# Altium project ProjektowanieObwodowDrukowanych.PrjPcb
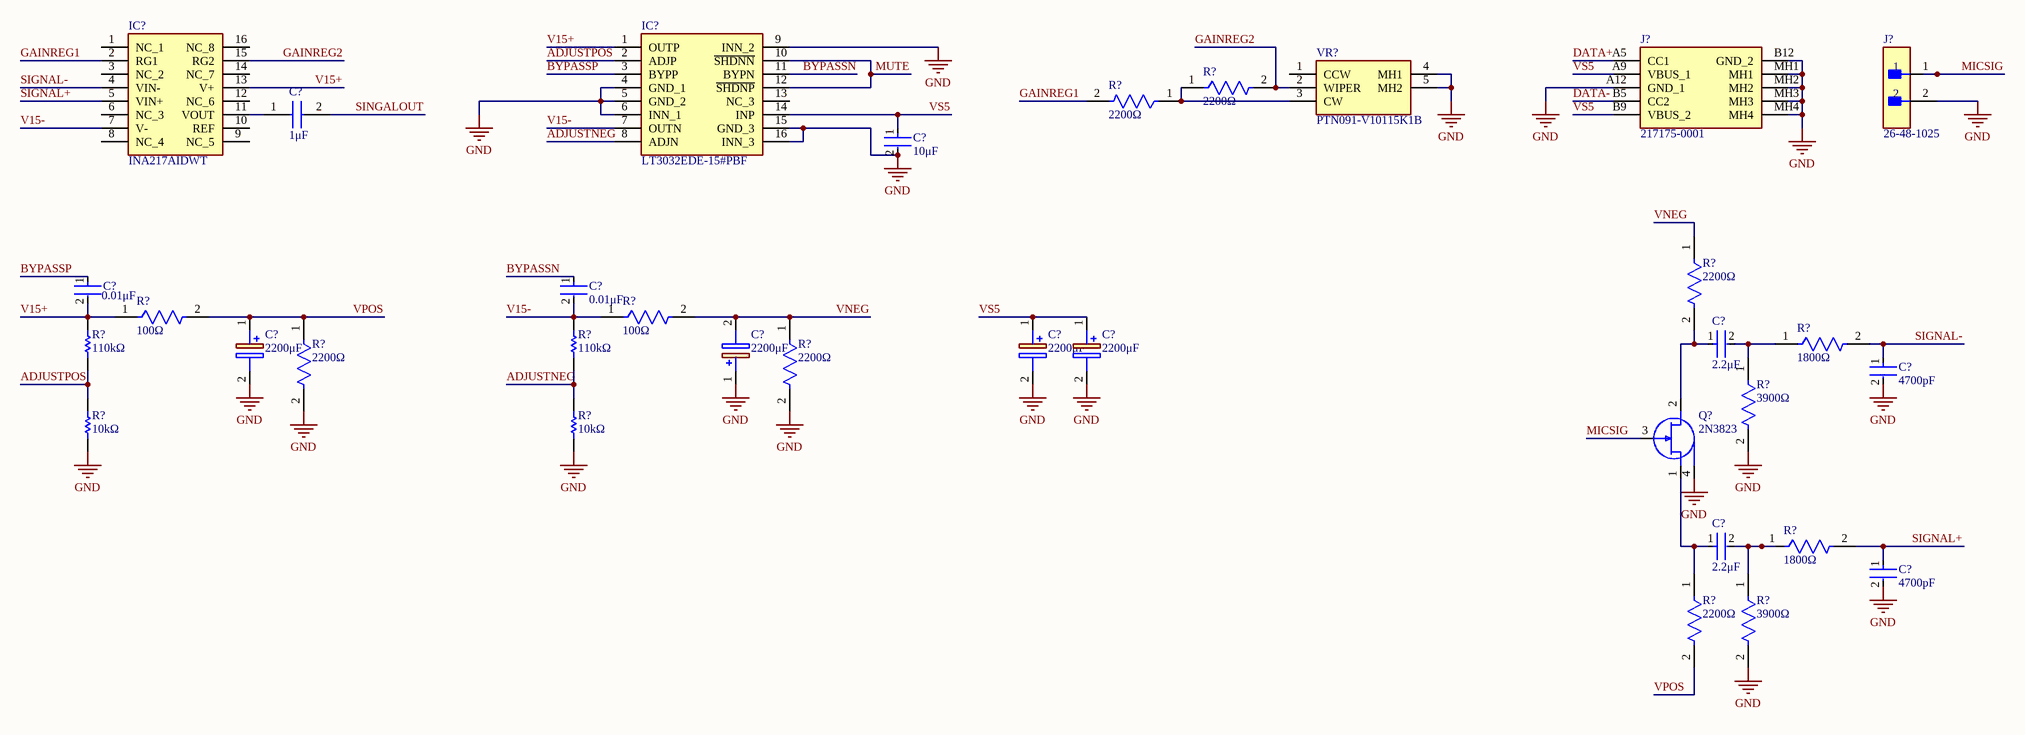
[diagram p0: Schemat.SchDoc]
1 sheet, 34 parts. Net scope: global (net labels, ports and power ports of the same name join across sheets).

## Sheet Schemat.SchDoc
size A3; SheetNumber: 1; SheetTotal: 1

### Parts
(Parts that share a designator on the sheet are numbered #1, #2 ... from top to bottom, then left to right.)
C?#1  1μF  [BFC241671005]
C?#2  10μF  [FP-C0603C-CF-MFG]
C?#3  0.01μF  [FP-C0603C-CF-MFG]
C?#4  0.01μF  [FP-C0603C-CF-MFG]
C?#5  2200μF  [CAPPRD500W65D1250H2700]
C?#6  2200μF  [CAPPRD500W65D1250H2700]
C?#7  2200μF  [CAPPRD500W65D1250H2700]
C?#8  2.2μF  [FP-R82DC4100DQ60J-MFG]
C?#9  4700pF  [FP-R82DC4100DQ60J-MFG]
C?#10  2200μF  [CAPPRD500W65D1250H2700]
C?#11  2.2μF  [FP-R82DC4100DQ60J-MFG]
C?#12  4700pF  [FP-R82DC4100DQ60J-MFG]
IC?#1  INA217AIDWT  [SOIC127P1030X265-16N]
IC?#2  LT3032EDE-15#PBF  [LT3032EDE15PBF]
J?#1  217175-0001  [2171750001]
J?#2  26-48-1025  [FP-26-48-1025-MFG]
Q?  2N3823  [2N4222A]
R?#1  2200Ω  [FP-MBB0207-MFG]
R?#2  2200Ω  [FP-MBB0207-MFG]
R?#3  2200Ω  [FP-MBB0207-MFG]
R?#4  100Ω  [FP-MRS25-MFG]
R?#5  2200Ω  [FP-MBB0207-MFG]
R?#6  100Ω  [FP-MRS25-MFG]
R?#7  2200Ω  [FP-MBB0207-MFG]
R?#8  1800Ω  [FP-MBB0207-MFG]
R?#9  110kΩ  [RESC1609X50X30NL8T20]
R?#10  110kΩ  [RESC1609X50X30NL8T20]
R?#11  3900Ω  [FP-MBB0207-MFG]
R?#12  10kΩ  [RESC1609X50X30NL8T20]
R?#13  10kΩ  [RESC1609X50X30NL8T20]
R?#14  1800Ω  [FP-MBB0207-MFG]
R?#15  2200Ω  [FP-MBB0207-MFG]
R?#16  3900Ω  [FP-MBB0207-MFG]
VR?  PTN091-V10115K1B  [PTN091V10115K1B]

### Nets
GND: C?#2.2 C?#5.2(-) C?#6.2(-) C?#7.2(-) C?#9.2 C?#10.1(+) C?#12.2 IC?#2.4(GND_1) IC?#2.5(GND_2) IC?#2.6(INN_1) IC?#2.9(INN_2) IC?#2.15(GND_3) IC?#2.16(INN_3) J?#1.A12(GND_1) J?#1.B12(GND_2) J?#1.MH1 J?#1.MH2 J?#1.MH3 J?#1.MH4 J?#2.2 Q?.4(C) R?#5.2 R?#7.2 R?#11.2 R?#12.1 R?#13.1 R?#16.2 VR?.4(MH1) VR?.5(MH2)
ADJUSTNEG: IC?#2.8(ADJN) R?#10.1 R?#13.2
ADJUSTPOS: IC?#2.2(ADJP) R?#9.1 R?#12.2
BYPASSN: C?#4.1 IC?#2.11(BYPN)
BYPASSP: C?#3.1 IC?#2.3(BYPP)
DATA+: J?#1.A5(CC1)
DATA-: J?#1.B5(CC2)
GAINREG1: IC?#1.2(RG1) R?#2.2
GAINREG2: IC?#1.15(RG2) R?#1.2 VR?.2(WIPER)
MICSIG: J?#2.1 Q?.3(G)
MUTE: IC?#2.10(~{SHDNN}) IC?#2.12(~{SHDNP})
SIGNAL+: C?#12.1 IC?#1.5(VIN+) R?#14.2
SIGNAL-: C?#9.1 IC?#1.4(VIN-) R?#8.2
SINGALOUT: C?#1.2
V15+: C?#3.2 IC?#1.13(V+) IC?#2.1(OUTP) R?#4.1 R?#9.2
V15-: C?#4.2 IC?#1.7(V-) IC?#2.7(OUTN) R?#6.1 R?#10.2
VNEG: C?#10.2(-) R?#3.1 R?#6.2 R?#7.1
VPOS: C?#5.1(+) R?#4.2 R?#5.1 R?#15.2
VS5: C?#2.1 C?#6.1(+) C?#7.1(+) IC?#2.14(INP) J?#1.A9(VBUS_1) J?#1.B9(VBUS_2)
NetC?#1_1: C?#1.1 IC?#1.11(VOUT)
NetC?#8_1: C?#8.1 Q?.2(D) R?#3.2
NetC?#8_2: C?#8.2 R?#8.1 R?#11.1
NetC?#11_1: C?#11.1 Q?.1(S) R?#15.1
NetC?#11_2: C?#11.2 R?#14.1 R?#16.1
NetR?#1_1: R?#1.1 R?#2.1 VR?.3(CW)

Not connected (* = marked no-connect by the designer): IC?#1 1(NC_1) 3(NC_2) 6(NC_3) 8(NC_4) 9(NC_5) 10(REF) 12(NC_6) 14(NC_7) 16(NC_8); IC?#2 13(NC_3); VR? 1(CCW)

### Library data of the parts
C?#1 = BFC241671005: Capacitor; Manufacturer_Name: Vishay; Capacitance: 1uF; Datasheet Link: https://www.vishay.com/docs/28128/mkp416to420.pdf; Height: 16.5mm; Manufacturer_Part_Number: BFC241671005; Mouser Part Number: 594-2222-416-71005; Mouser Price/Stock: https://www.mouser.co.uk/ProductDetail/Vishay-BC-Components/BFC241671005?qs=IGgxCalrOc4S3cwCzhpbjg%3D%3D
C?#2 = CMP-2006-03061-2: CAP CER 10UF 50V X7R 0603; Manufacturer: KEMET; Manufacturer Part Number: C0603C104K5RACTU; Tolerance: 0.1; Description: C0603 0.10 μF X7R 30ppm/°C 10.00% 50 V; Temperature Coefficient: 30ppm/°C; Material: Ceramic; Automotive Grade: Grade 1; Temperature: -55°C to +125°C; RoHS: TRUE; Temperature Range High: +125°C; Lead Free: Yes; Octopart: https://octopart.com/c0603c104k5ractu-kemet-139244; Digikey Description: CAP CER 0.1UF 50V X7R 0603; Category: Cap; Package: C0603C-CF; ComponentLink2Description: Datasheet; Temperature Range Low: -55°C; Device Class L1: Passive Components; Voltage Rating: 50 V; Value: 10 μF; Automotive: Yes; Device Class L3: Ceramic Capacitors; ComponentLink2URL: https://api.kemet.com/component-edge/download/datasheet/C0603C100J5GACAUTO.pdf; Capacitance: 10μF; Device Class L2: Capacitors; Temperature Characteristic: X7R; Height: 0.87mm
C?#3 C?#4 = CMP-2006-03061-2: CAP CER 0.01UF 50V X7R 0603; Manufacturer: KEMET; Manufacturer Part Number: C0603C104K5RACTU; Tolerance: 0.1; Description: C0603 0.10 μF X7R 30ppm/°C 10.00% 50 V; Temperature Coefficient: 30ppm/°C; Material: Ceramic; Automotive Grade: Grade 1; Temperature: -55°C to +125°C; RoHS: TRUE; Temperature Range High: +125°C; Lead Free: Yes; Octopart: https://octopart.com/c0603c104k5ractu-kemet-139244; Digikey Description: CAP CER 0.1UF 50V X7R 0603; Category: Cap; Package: C0603C-CF; ComponentLink2Description: Datasheet; Temperature Range Low: -55°C; Device Class L1: Passive Components; Voltage Rating: 50 V; Value: 0.01 μF; Automotive: Yes; Device Class L3: Ceramic Capacitors; ComponentLink2URL: https://api.kemet.com/component-edge/download/datasheet/C0603C100J5GACAUTO.pdf; Capacitance: 0.01 μF; Device Class L2: Capacitors; Temperature Characteristic: X7R; Height: 0.87mm
C?#5-C?#7 C?#10 = EEU-FS1E222B: Capacitor Polarised; Manufacturer_Name: Panasonic; Capacitance: 2200uF; Datasheet Link: http://industrial.panasonic.com/cdbs/www-data/pdf/RDF0000/ABA0000C1255.pdf; Height: 27mm; Manufacturer_Part_Number: EEU-FS1E222B; Mouser Part Number: 667-EEU-FS1E222B; Mouser Price/Stock: https://www.mouser.co.uk/ProductDetail/Panasonic/EEU-FS1E222B?qs=gt1LBUVyoHkbWosguZp9NA%3D%3D; Arrow Part Number: EEU-FS1E222B; Arrow Price/Stock: https://www.arrow.com/en/products/eeu-fs1e222b/panasonic
C?#8 C?#11 = CMP-03022-000017-1: CAP FILM 1UF 5% 63VDC RADIAL; Capacitance: 2.2uF; Voltage Rating (DC): 63V; Lead Diameter: 0.5mm; Insulation Resistance: 30R; Dielectric: PET; Voltage Rating (AC): 40V; Dissipation Factor: 80%; Life (Hours): 2000Hour; Type: General Purpose; Mount: Through Hole; Case/Package: Radial; Package Quantity: 1700; Construction: RADIAL; Lead Pitch: 5mm; Depth: 5mm; Series: R82; Packaging: Tape and Reel; RoHS Compliant: Yes; Voltage Rating: 63V; Height - Seated (Max): 0.398inch; Voltage: 63V; Radiation Hardening: No; Width: 5mm; REACH SVHC: No SVHC; Min Operating Temperature: -55°C; Tolerance: 5%; Dielectric Material: PET; Contact Plating: Tin; Termination: Radial; Length: 7.2mm; Max Operating Temperature: 105°C
C?#9 C?#12 = CMP-03022-000017-1: CAP FILM 1UF 5% 63VDC RADIAL; Voltage Rating (DC): 63V; Lead Diameter: 0.5mm; Insulation Resistance: 30R; Dielectric: PET; Voltage Rating (AC): 40V; Dissipation Factor: 80%; Life (Hours): 2000Hour; Type: General Purpose; Mount: Through Hole; Case/Package: Radial; Package Quantity: 1700; Construction: RADIAL; Capacitance: 4700pF; Lead Pitch: 5mm; Depth: 5mm; Series: R82; Packaging: Tape and Reel; RoHS Compliant: Yes; Voltage Rating: 63V; Height - Seated (Max): 0.398inch; Voltage: 63V; Radiation Hardening: No; Width: 5mm; REACH SVHC: No SVHC; Min Operating Temperature: -55°C; Tolerance: 5%; Dielectric Material: PET; Contact Plating: Tin; Termination: Radial; Length: 7.2mm; Max Operating Temperature: 105°C
IC?#1 = INA217AIDWT: Integrated Circuit; Manufacturer_Name: Texas Instruments; Datasheet Link: http://www.ti.com/lit/ds/symlink/ina217.pdf; Height: 2.65mm; Manufacturer_Part_Number: INA217AIDWT; Mouser Part Number: 595-INA217AIDWT; Mouser Price/Stock: https://www.mouser.co.uk/ProductDetail/Texas-Instruments/INA217AIDWT?qs=VBduBm9rCJS9BM9U1hAvwg%3D%3D; Arrow Part Number: INA217AIDWT; Arrow Price/Stock: https://www.arrow.com/en/products/ina217aidwt/texas-instruments?region=nac
IC?#2 = LT3032EDE-15#PBF: Integrated Circuit; Manufacturer_Name: Analog Devices; Datasheet Link: https://www.analog.com/media/en/technical-documentation/data-sheets/3032ff.pdf; Height: 0.8mm; Manufacturer_Part_Number: LT3032EDE-15#PBF; Mouser Part Number: 584-LT3032EDE-15#PBF; Mouser Price/Stock: https://www.mouser.co.uk/ProductDetail/Analog-Devices/LT3032EDE-15PBF?qs=ytflclh7QUVyzHIC%252Bw5Cng%3D%3D; Arrow Part Number: LT3032EDE-15#PBF; Arrow Price/Stock: https://www.arrow.com/en/products/lt3032ede-15pbf/analog-devices?region=nac
J?#1 = 217175-0001: Connector; Manufacturer_Name: Molex; Datasheet Link: https://www.molex.com/pdm_docs/sd/2171750001_sd.pdf; Height: 3.46mm; Manufacturer_Part_Number: 217175-0001; Mouser Part Number: 538-217175-0001; Mouser Price/Stock: https://www.mouser.co.uk/ProductDetail/Molex/217175-0001?qs=DRkmTr78QARWJMiqNnldSg%3D%3D
J?#2 = CMP-04776-000772-1: CONN HEADER VERT 2POS 3.96MM; Max Current Rating: 6A; Number of Contacts: 2; Approvals: UL; Voltage Rating (AC): 250V; Gender: Male; Contact Resistance: 10mR; Connector Type: Male Pin; Current Rating: 7A; Packaging: Bulk; Fastening Type: Friction; Flammability Rating: UL94 V-0; Contact Type: Male Pin; Termination: Solder; Pitch: 3.96mm; Radiation Hardening: No; Number of Rows: 1; Contact Material: Brass; RoHS Compliant: Yes; Contact Plating: Tin; Depth: 9.02mm; Package Quantity: 100; Housing Color: Black; Series: KK® 41671; Color: Black; Number of Positions: 2; Length: 7.87mm; Contact Mating Length: 0.45inch; Max Operating Temperature: 75°C; Min Operating Temperature: 0°C; Mount: Through Hole; Voltage Rating: 250V; Orientation: Straight; Housing Material: Polyester; Height: 12.8mm; Lead Pitch: 3.96mm
Q? = 2N3823: JFET (N-Channel) inc. Case; Manufacturer_Name: Qorvo; Datasheet Link: https://www.interfet.com/jfet-datasheets/jfet-2n3823-2n3824-interfet.pdf; Height: 5.33mm; Manufacturer_Part_Number: 2N3823; Mouser Part Number: 106-2N3823; Mouser Price/Stock: https://www.mouser.co.uk/ProductDetail/InterFET/2N3823?qs=1NkvD5QbL4FCaUOVGdM09Q%3D%3D
R?#1-R?#3 R?#5 R?#7 R?#15 = CMP-02408-000043-1: Res Thin Film 56.2K Ohm 0.1% 2/5W 25ppm/C Conformal AXL Thru-Hole Ammo Pack; Temperature Coefficient: 25ppm/°C; Resistance: 2.2kR; Diameter: 2.5mm; Max Operating Temperature: 125°C; Mount: Through Hole; Radiation Hardening: No; Lead Free: Lead Free; Case/Package: Conformal; Length: 6.3mm; Min Operating Temperature: -55°C; Contact Plating: Tin; RoHS Compliant: Yes; Tolerance: 0.1%; Resistor Type: Thin Film
R?#4 R?#6 = CMP-02408-000051-1: RES 1K OHM 0.6W 1% AXIAL; Power Rating: 600mW; Lead Diameter: 0.6mm; Voltage Rating (DC): 350V; Resistance: 100R; Temperature Coefficient: 50ppm/°C; Width: 2.5mm; Military Standard: Not; Package Quantity: 5000; Radiation Hardening: No; Case/Package: Axial; Resistance Tolerance: 1%; Resistor Type: Metal Film; Contact Plating: Tin; Length: 6.5mm; Lead Free: Lead Free; RoHS Compliant: Yes; Mount: Through Hole; Number of Pins: 2; Technology: THIN FILM; Voltage Rating: 350V; Min Operating Temperature: -55°C; Weight: 0.00776oz; Diameter: 2.5mm; Construction: Cylindrical; Series: MRS25; Tolerance: 1%; Packaging: Tape and Reel; Max Operating Temperature: 155°C; Max Power Dissipation: 600mW; Number of Terminations: 2; Termination: Axial
R?#8 R?#14 = CMP-02408-000043-1: Res Thin Film 56.2K Ohm 0.1% 2/5W 25ppm/C Conformal AXL Thru-Hole Ammo Pack; Temperature Coefficient: 25ppm/°C; Resistance: 1.8kR; Diameter: 2.5mm; Max Operating Temperature: 125°C; Mount: Through Hole; Radiation Hardening: No; Lead Free: Lead Free; Case/Package: Conformal; Length: 6.3mm; Min Operating Temperature: -55°C; Contact Plating: Tin; RoHS Compliant: Yes; Tolerance: 0.1%; Resistor Type: Thin Film
R?#9 R?#10 = CMP-1666-00005-4: Chip Resistor, 10 KOhm, +/- 1%, 100 mW, -55 to 155 degC, 0603 (1608 Metric), RoHS, Tape and Reel; Manufacturer: Vishay Semiconductor; Voltage Rating: 75 V; Resistance: 110kOhm; Max Operating Temperature: 155 degC; PackageDescription: 2-Pin Surface Mount Device, Body 1.575 x 0.85 mm; ComponentLink1Description: Manufacturer URL; RoHSCompliant: true; PackageReference: 0603; REACH SVHC: Unknown; Length: 1.55 mm; DatasheetVersion: 06/2012; Packaging: Tape and Reel; Min Operating Temperature: -55 degC; Mounting Technology: Surface Mount; ComponentLink2URL: https://datasheet.ciiva.com/11809/0900766b80d98afc-11809037.pdf; Height: 0.45 mm; ComponentLink2Description: Datasheet; Package Quantity: 5000; ComponentLink1URL: http://www.vishay.com/
R?#11 R?#16 = CMP-02408-000043-1: Res Thin Film 56.2K Ohm 0.1% 2/5W 25ppm/C Conformal AXL Thru-Hole Ammo Pack; Temperature Coefficient: 25ppm/°C; Resistance: 3.9kR; Diameter: 2.5mm; Max Operating Temperature: 125°C; Mount: Through Hole; Radiation Hardening: No; Lead Free: Lead Free; Case/Package: Conformal; Length: 6.3mm; Min Operating Temperature: -55°C; Contact Plating: Tin; RoHS Compliant: Yes; Tolerance: 0.1%; Resistor Type: Thin Film
R?#12 R?#13 = CMP-1666-00005-4: Chip Resistor, 10 KOhm, +/- 1%, 100 mW, -55 to 155 degC, 0603 (1608 Metric), RoHS, Tape and Reel; Manufacturer: Vishay Semiconductor; Voltage Rating: 75 V; Resistance: 10kOhm; Max Operating Temperature: 155 degC; PackageDescription: 2-Pin Surface Mount Device, Body 1.575 x 0.85 mm; ComponentLink1Description: Manufacturer URL; RoHSCompliant: true; PackageReference: 0603; REACH SVHC: Unknown; Length: 1.55 mm; DatasheetVersion: 06/2012; Packaging: Tape and Reel; Min Operating Temperature: -55 degC; Mounting Technology: Surface Mount; ComponentLink2URL: https://datasheet.ciiva.com/11809/0900766b80d98afc-11809037.pdf; Height: 0.45 mm; ComponentLink2Description: Datasheet; Package Quantity: 5000; ComponentLink1URL: http://www.vishay.com/
VR? = PTN091-V10115K1B: Variable Resistor; Manufacturer_Name: Same Sky; Datasheet Link: https://www.sameskydevices.com/product/resource/ptn09x.pdf; Height: 24.7mm; Manufacturer_Part_Number: PTN091-V10115K1B; Mouser Part Number: 179-PTN091V10115K1B; Mouser Price/Stock: https://www.mouser.co.uk/ProductDetail/Same-Sky/PTN091-V10115K1B?qs=IKkN%2F947nfDKcGbyc2sMDg%3D%3D